# Altium project Controller.PrjPcb
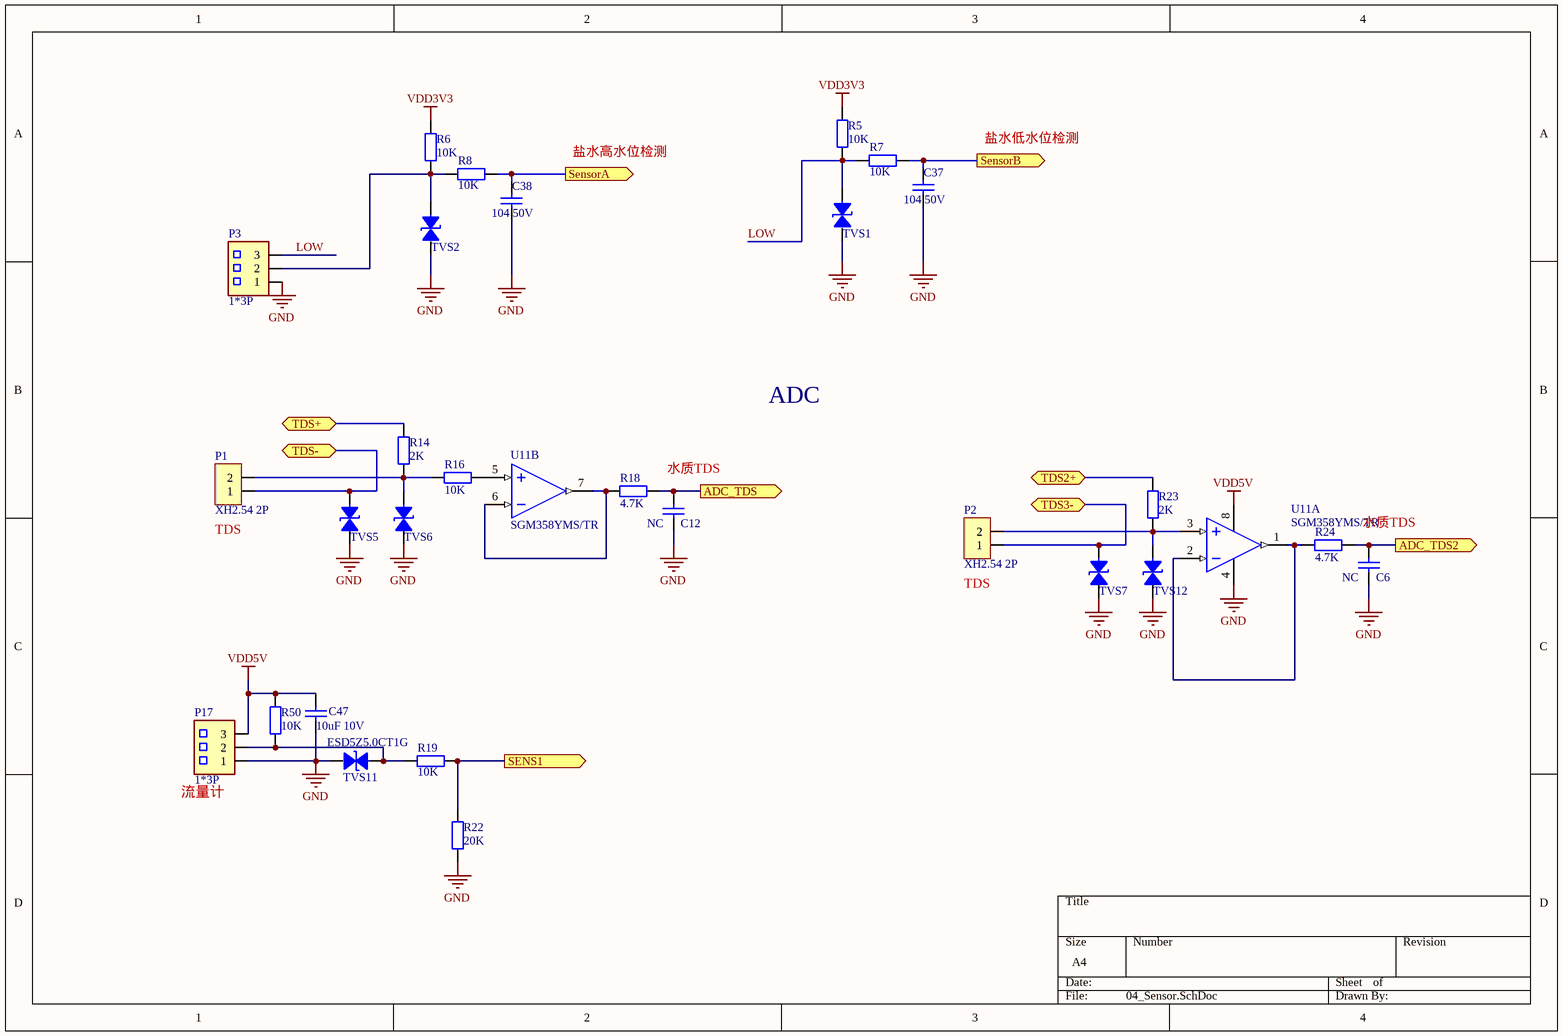
[diagram p0: 04_Sensor.SchDoc]
6 sheets, 167 parts. Net scope: global (net labels, ports and power ports of the same name join across sheets).
Board file: 电解模块主控板_V1.1_ZM_20210918.PcbDoc
Sheets:
  04_Sensor.SchDoc
  08_Peripherals.SchDoc
  02_Power.SchDoc
  com.SchDoc
  15_LCD.SchDoc
  07_EL_CON.SchDoc

## Sheet 04_Sensor.SchDoc
size A4

### Parts
C6  NC  [0603C]
C12  NC  [SMD-0603C]
C37  104 50V  [SMD-0603C]
C38  104 50V  [SMD-0603C]
C47  10uF 10V  [SMD-0603C]
P1  XH2.54 2P  [SIP-2A]
P2  XH2.54 2P  [SIP-2A]
P3  1*3P  [3X2MMZ]
P17  1*3P  [3X2.54MMZ2]
R5  10K  [SMD-0603]
R6  10K  [SMD-0603]
R7  10K  [SMD-0603]
R8  10K  [SMD-0603]
R14  2K  [SMD-0603]
R16  10K  [SMD-0603]
R18  4.7K  [SMD-0603]
R19  10K  [SMD-0603]
R22  20K  [SMD-0603]
R23  2K  [0603R]
R24  4.7K  [0603R]
R50  10K  [SMD-0603]
TVS1  ESD5Z5.0CT1G  [SOD-523]  (value not drawn)
TVS2  ESD5Z5.0CT1G  [SOD-523]  (value not drawn)
TVS5  ESD5Z5.0CT1G  [SOD-523]  (value not drawn)
TVS6  ESD5Z5.0CT1G  [SOD-523]  (value not drawn)
TVS7  ESD5Z5.0CT1G  [SOD-523]  (value not drawn)
TVS11  ESD5Z5.0CT1G  [SOD-523]
TVS12  ESD5Z5.0CT1G  [SOD-523]  (value not drawn)
U11  SGM358YMS/TR  [MSOP-8]  (parts A,B of 2)

### Ports
ADC_TDS2 (out), ADC_TDS (out), SENS1 (out), SensorA (out), SensorB (out), TDS2+ (bidir), TDS3- (bidir), TDS+ (bidir), TDS- (bidir)

### Nets
GND: C6.1 C12.1 C37.1 C38.1 C47.1 P3.1 P17.1 R22.1 TVS1.1(A) TVS2.1(A) TVS5.1(A) TVS6.1(A) TVS7.1(A) TVS11.1(A) TVS12.1(A) U11.4(V-)
VDD3V3: R5.1 R6.1  [project net 3.3V]
VDD5V: C47.2 P17.3 R50.1 U11.8(V+)
LOW: P3.3 R5.2 R7.1 TVS1.2(B)
NetC6_2: C6.2 R24.1 ; port ADC_TDS2
NetC12_2: C12.2 R18.1 ; port ADC_TDS
NetC37_2: C37.2 R7.2 ; port SensorB
NetC38_2: C38.2 R8.2 ; port SensorA
NetP1_1: P1.1 TVS5.2(B) ; port TDS-
NetP1_2: P1.2 R14.2 R16.1 TVS6.2(B)
NetP2_1: P2.1 TVS7.2(B) ; port TDS3-
NetP2_2: P2.2 R23.2 TVS12.2(B) U11.3(IN1+)
NetP3_2: P3.2 R6.2 R8.1 TVS2.2(B)
NetP17_2: P17.2 R19.1 R50.2 TVS11.2(B)
NetR14_1: R14.1 ; port TDS+
NetR16_2: R16.2 U11.5(IN2+)
NetR18_2: R18.2 U11.6(IN2-) U11.7(OUT2)
NetR19_2: R19.2 R22.2 ; port SENS1
NetR23_1: R23.1 ; port TDS2+
NetR24_2: R24.2 U11.1(OUT1) U11.2(IN1-)

### Notes on the sheet
- 盐水高水位检测
- 盐水低水位检测
- ADC
- 水质TDS
- (near P1) TDS
- (near P2) TDS
- (near P17) 流量计

### Library data of the parts
C6 C12 = CAP4: 贴片电容 10%
C37 C38 = CAP4: 贴片电容 20%
C47 = 0805 22uF (226) 20% 25V: 贴片电容 10%; value: 22uF 10V X5R; ComponentLink1Description: 供应商链接; ComponentLink1URL: http://www.szlcsc.com/product/details_46786.html; Package: 0805; Supplier: LC; SuppliersPartNumber: C45783
P1 P2 = SIP-2: XH2.54 2P 直插
P3 P17 = HDR1*3
R5-R8 R14 R16 R23 = RES0: 贴片电阻 1%
R18 R24 = RES0: 贴片电阻 5%
R19 R22 R50 = 0603 10KΩ (1002) 1%: 贴片电阻 5%; ComponentLink1Description: 供应商链接; ComponentLink1URL: http://www.szlcsc.com/product/details_26547.html; Package: 0603; Supplier: LC; SuppliersPartNumber: C25804
TVS1 TVS2 TVS5-TVS7 TVS12 = TVS-1: TVS
TVS11 = TVS-1: TVS 5.0V
U11 = LM358: 运放

## Sheet 08_Peripherals.SchDoc
size A4
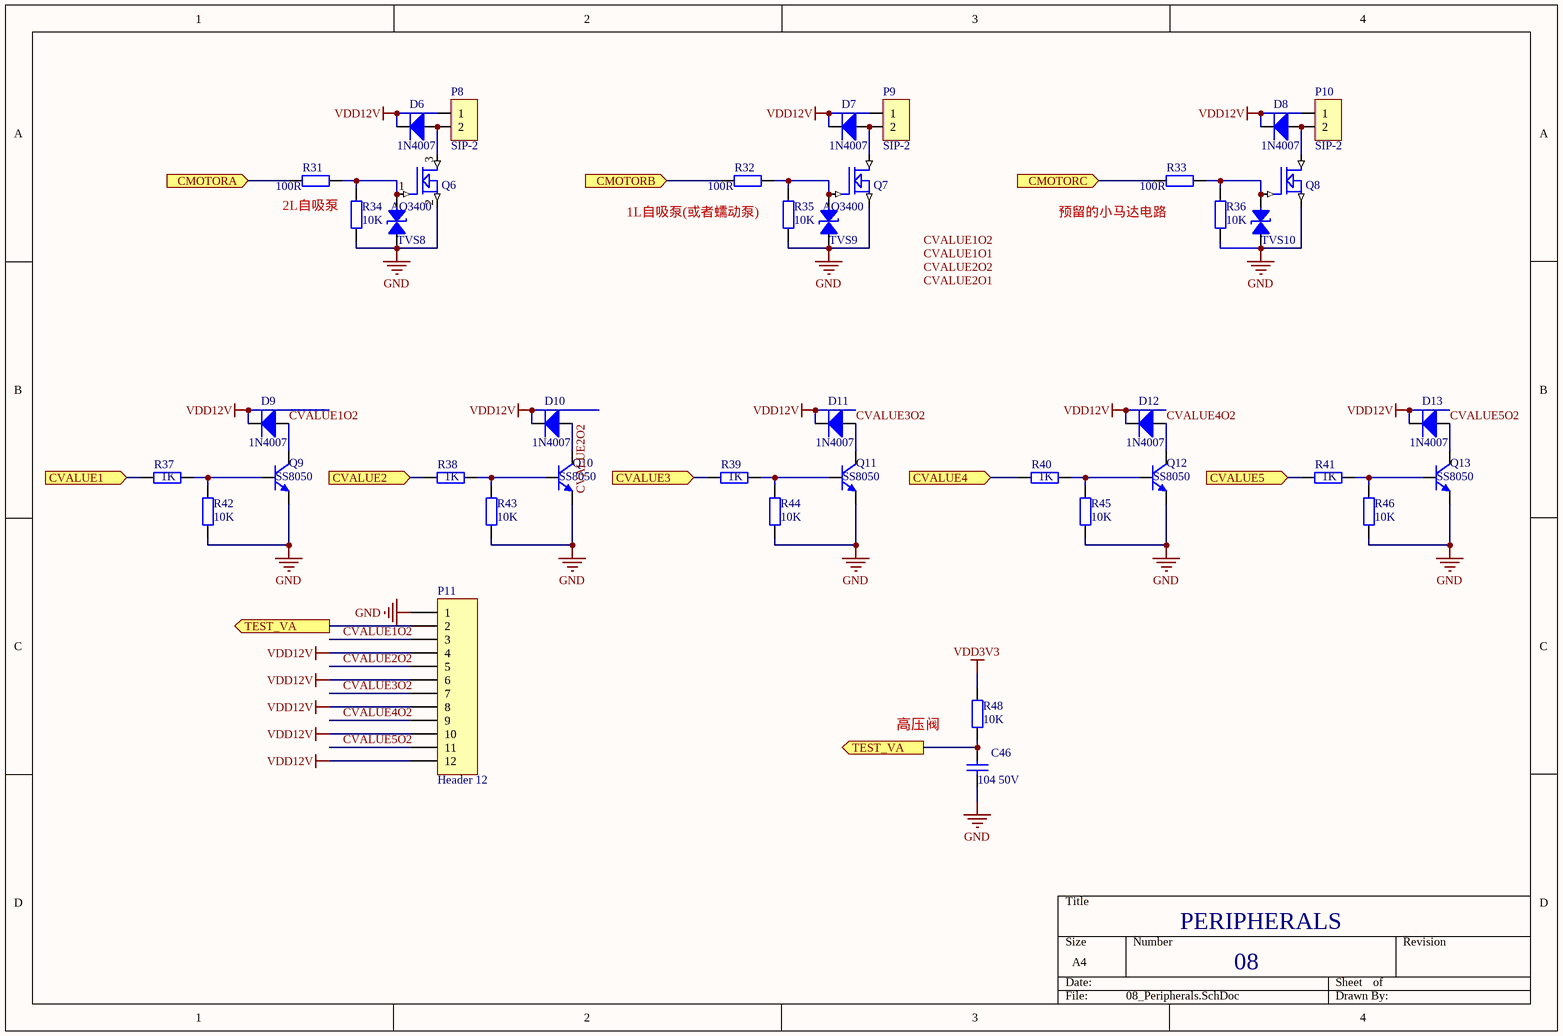
[diagram p1: 08_Peripherals.SchDoc]

### Parts
C46  104 50V  [SMD-0603C]
D6  1N4007  [DO-214-AC]
D7  1N4007  [DO-214-AC]
D8  1N4007  [DO-214-AC]
D9  1N4007  [DO-214-AC]
D10  1N4007  [DO-214-AC]
D11  1N4007  [DO-214-AC]
D12  1N4007  [DO-214-AC]
D13  1N4007  [DO-214-AC]
P8  SIP-2  [SIP-2A]
P9  SIP-2  [SIP-2A]
P10  SIP-2  [SIP-2A]
P11  Header 12  [12X2.54MMZ]
Q6  AO3400  [SOT-23]
Q7  AO3400  [SOT-23]
Q8  AO3400  [SOT-23]  (value not drawn)
Q9  SS8050  [SOT-23]
Q10  SS8050  [SOT-23]
Q11  SS8050  [SOT-23]
Q12  SS8050  [SOT-23]
Q13  SS8050  [SOT-23]
R31  100R  [SMD-0603]
R32  100R  [SMD-0603]
R33  100R  [SMD-0603]
R34  10K  [SMD-0603]
R35  10K  [SMD-0603]
R36  10K  [SMD-0603]
R37  1K  [SMD-0603]
R38  1K  [SMD-0603]
R39  1K  [SMD-0603]
R40  1K  [SMD-0603]
R41  1K  [SMD-0603]
R42  10K  [SMD-0603]
R43  10K  [SMD-0603]
R44  10K  [SMD-0603]
R45  10K  [SMD-0603]
R46  10K  [SMD-0603]
R48  10K  [SMD-0603]
TVS8  ESD5Z5.0CT1G  [SOD-523]  (value not drawn)
TVS9  ESD5Z5.0CT1G  [SOD-523]  (value not drawn)
TVS10  ESD5Z5.0CT1G  [SOD-523]  (value not drawn)

### Ports
CMOTORA (in), CMOTORB (in), CMOTORC (in), CVALUE1 (in), CVALUE2 (in), CVALUE3 (in), CVALUE4 (in), CVALUE5 (in), TEST_VA (out)

### Nets
GND: C46.1 P11.1 Q6.2(S) Q7.2(S) Q8.2(S) Q9.2(E) Q10.2(E) Q11.2(E) Q12.2(E) Q13.2(E) R34.2 R35.2 R36.2 R42.2 R43.2 R44.2 R45.2 R46.2 TVS8.1(A) TVS9.1(A) TVS10.1(A)
VDD3V3: R48.2  [project net 3.3V]
VDD12V: D6.2(K) D7.2(K) D8.2(K) D9.2(K) D10.2(K) D11.2(K) D12.2(K) D13.2(K) P8.1 P9.1 P10.1 P11.4 P11.6 P11.8 P11.10 P11.12
CVALUE1O2: D9.1(A) P11.3 Q9.3(C)
CVALUE2O2: D10.1(A) P11.5 Q10.3(C)
CVALUE3O2: D11.1(A) P11.7 Q11.3(C)
CVALUE4O2: D12.1(A) P11.9 Q12.3(C)
CVALUE5O2: D13.1(A) P11.11 Q13.3(C)
NetC46_2: C46.2 P11.2 R48.1 ; port TEST_VA
NetD6_1: D6.1(A) P8.2 Q6.3(D)
NetD7_1: D7.1(A) P9.2 Q7.3(D)
NetD8_1: D8.1(A) P10.2 Q8.3(D)
NetQ6_1: Q6.1(G) R31.1 R34.1 TVS8.2(B)
NetQ7_1: Q7.1(G) R32.1 R35.1 TVS9.2(B)
NetQ8_1: Q8.1(G) R33.1 R36.1 TVS10.2(B)
NetQ9_1: Q9.1(B) R37.1 R42.1
NetQ10_1: Q10.1(B) R38.1 R43.1
NetQ11_1: Q11.1(B) R39.1 R44.1
NetQ12_1: Q12.1(B) R40.1 R45.1
NetQ13_1: Q13.1(B) R41.1 R46.1
NetR31_2: R31.2 ; port CMOTORA
NetR32_2: R32.2 ; port CMOTORB
NetR33_2: R33.2 ; port CMOTORC
NetR37_2: R37.2 ; port CVALUE1
NetR38_2: R38.2 ; port CVALUE2
NetR39_2: R39.2 ; port CVALUE3
NetR40_2: R40.2 ; port CVALUE4
NetR41_2: R41.2 ; port CVALUE5

### Notes on the sheet
- (near R31) 2L自吸泵
- (near R32) 1L自吸泵(或者蠕动泵)
- 预留的小马达电路
- 高压阀
- PERIPHERALS
- 08
- Labels drawn without touching a wire or pin: CVALUE1O1, CVALUE1O2, CVALUE2O1, CVALUE2O2

### Library data of the parts
C46 = CAP4: 贴片电容 10%
D6-D13 = DIODE2: 贴片二极管
P8-P10 = SIP-2: XH2.54 2P 立贴
P11 = Header 12: Header, 12-Pin; LatestRevisionDate: 17-Jul-2002; LatestRevisionNote: Re-released for DXP Platform.; Publisher: Altium Limited
Q6-Q8 = MOSFET N
Q9-Q13 = NPN-1: 三极管
R31-R46 R48 = RES-SOP: 贴片电阻 5%
TVS8-TVS10 = TVS-1: TVS

## Sheet 02_Power.SchDoc
size A4
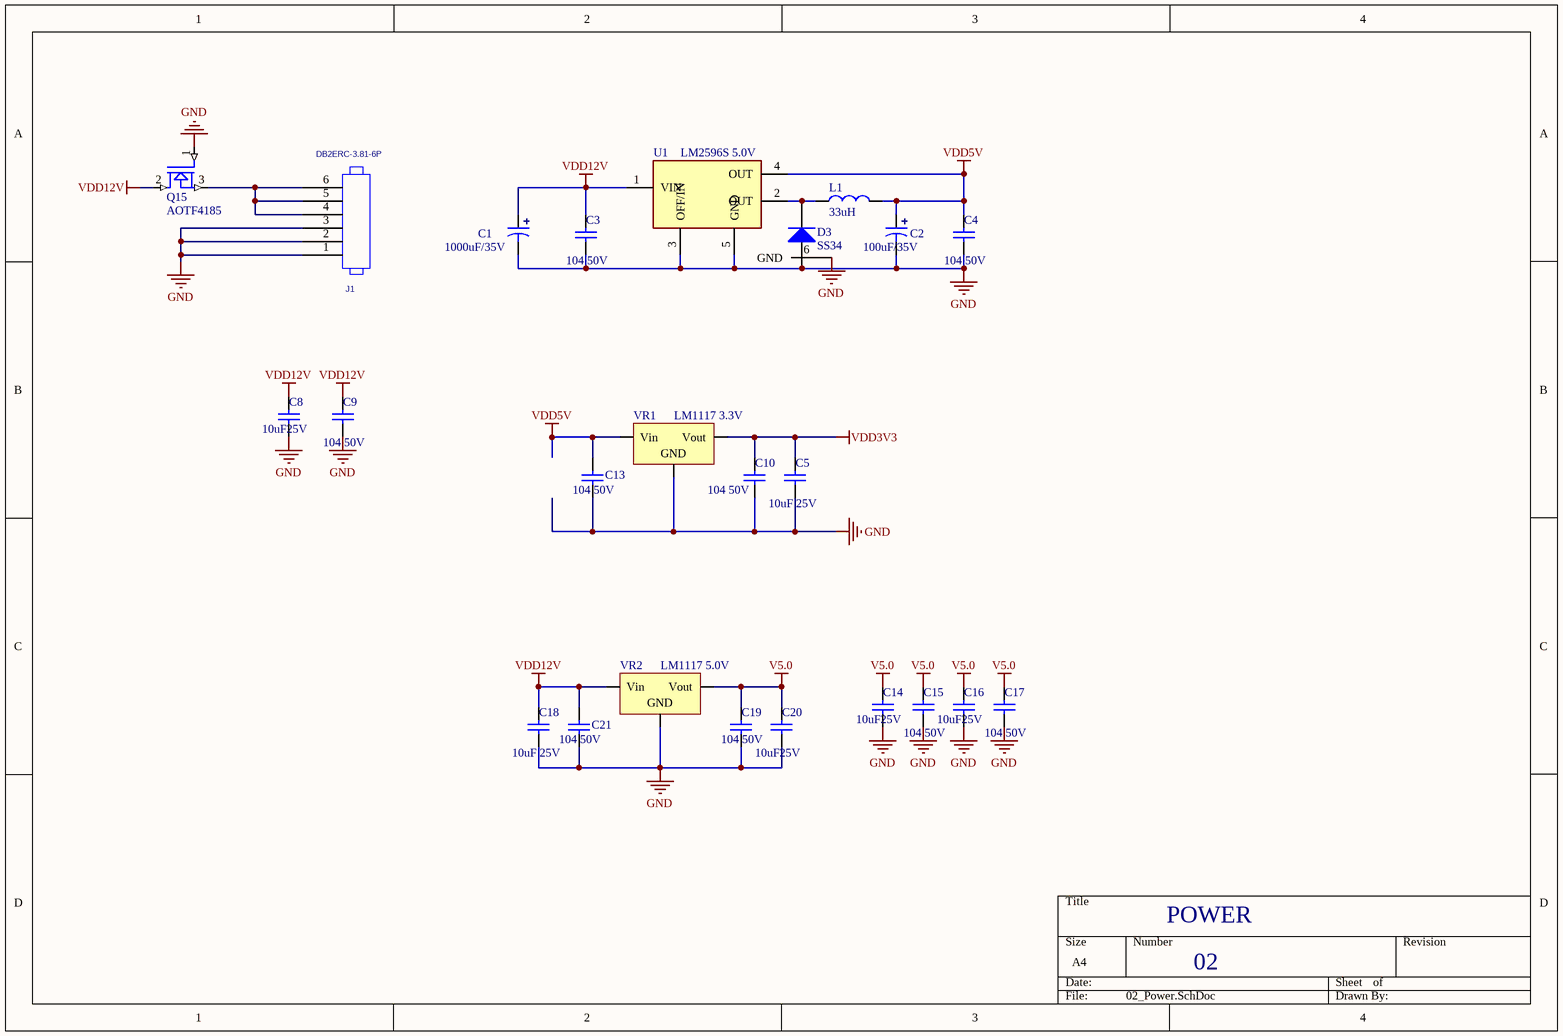
[diagram p2: 02_Power.SchDoc]

### Parts
C1  1000uF/35V  [10*16]
C2  100uF/35V  [6*8]
C3  104 50V  [SMD-0805C]
C4  104 50V  [SMD-0805C]
C5  10uF 25V  [SMD-0603C]
C8  10uF25V  [SMD-0603C]
C9  104 50V  [SMD-0603C]
C10  104 50V  [SMD-0603C]
C13  104 50V  [SMD-0603C]
C14  10uF25V  [SMD-0603C]
C15  104 50V  [SMD-0603C]
C16  10uF25V  [SMD-0603C]
C17  104 50V  [SMD-0603C]
C18  10uF 25V  [SMD-0603C]
C19  104 50V  [SMD-0603C]
C20  10uF25V  [SMD-0603C]
C21  104 50V  [SMD-0603C]
D3  SS34  [SMA]
J1  value DB2ERC-3.81-6P  [VH-AW-3.96*6P]  (hidden comment: HEADER_6)
L1  33uH  [CDRH-127]
Q15  AOTF4185  [to220]
U1  LM2596S 5.0V  [TO-263-5]
VR1  LM1117 3.3V  [SOT223]
VR2  LM1117 5.0V  [SOT223]

### Nets
GND: C1.2 C2.2 C3.1 C4.1 C5.1 C8.1 C9.1 C10.1 C13.1 C14.1 C15.1 C16.1 C17.1 C18.1 C19.1 C20.1 C21.1 D3.1(A) J1.1 J1.2 J1.3 Q15.1(G) U1.3(OFF/IN) U1.5(GND) U1.6(GND) VR1.1(GND) VR2.1(GND)
V5.0: C14.2 C15.2 C16.2 C17.2 C19.2 C20.2 VR2.2(Vout)
VDD3V3: C5.2 C10.2 VR1.2(Vout)  [project net 3.3V]
VDD5V: C2.1 C4.2 C13.2 L1.2 U1.4(OUT) VR1.3(Vin)
VDD12V: C1.1 C3.2 C8.2 C9.2 C18.2 C21.2 Q15.2(D) U1.1(VIN) VR2.3(Vin)
NetD3_2: D3.2(K) L1.1 U1.2(OUT)
NetJ1_4: J1.4 J1.5 J1.6 Q15.3(S)

### Notes on the sheet
- POWER
- 02

### Library data of the parts
C1 C2 = CAP2: 电解电容
C3 C4 C8-C10 C13 = CAP4: 贴片电容 10%
C5 C14-C21 = CAP4: 贴片电容 20%
D3 = DIODE
J1 = HEADER_6: PCB DECAL: DB2ERC-3P81-6P; Source_Path: C:\MYPROGRAM\CADENCE\SPB_16.6\TOOLS\CAPTURE\LIBRARY\CONNECTOR.OLB
L1 = IND
Q15 = MOSFET N
U1 = LM2596
VR1 = LM1117: 三端稳压器
VR2 = LM1117: 三端稳压器 （耐压20V）

## Sheet com.SchDoc
size A4
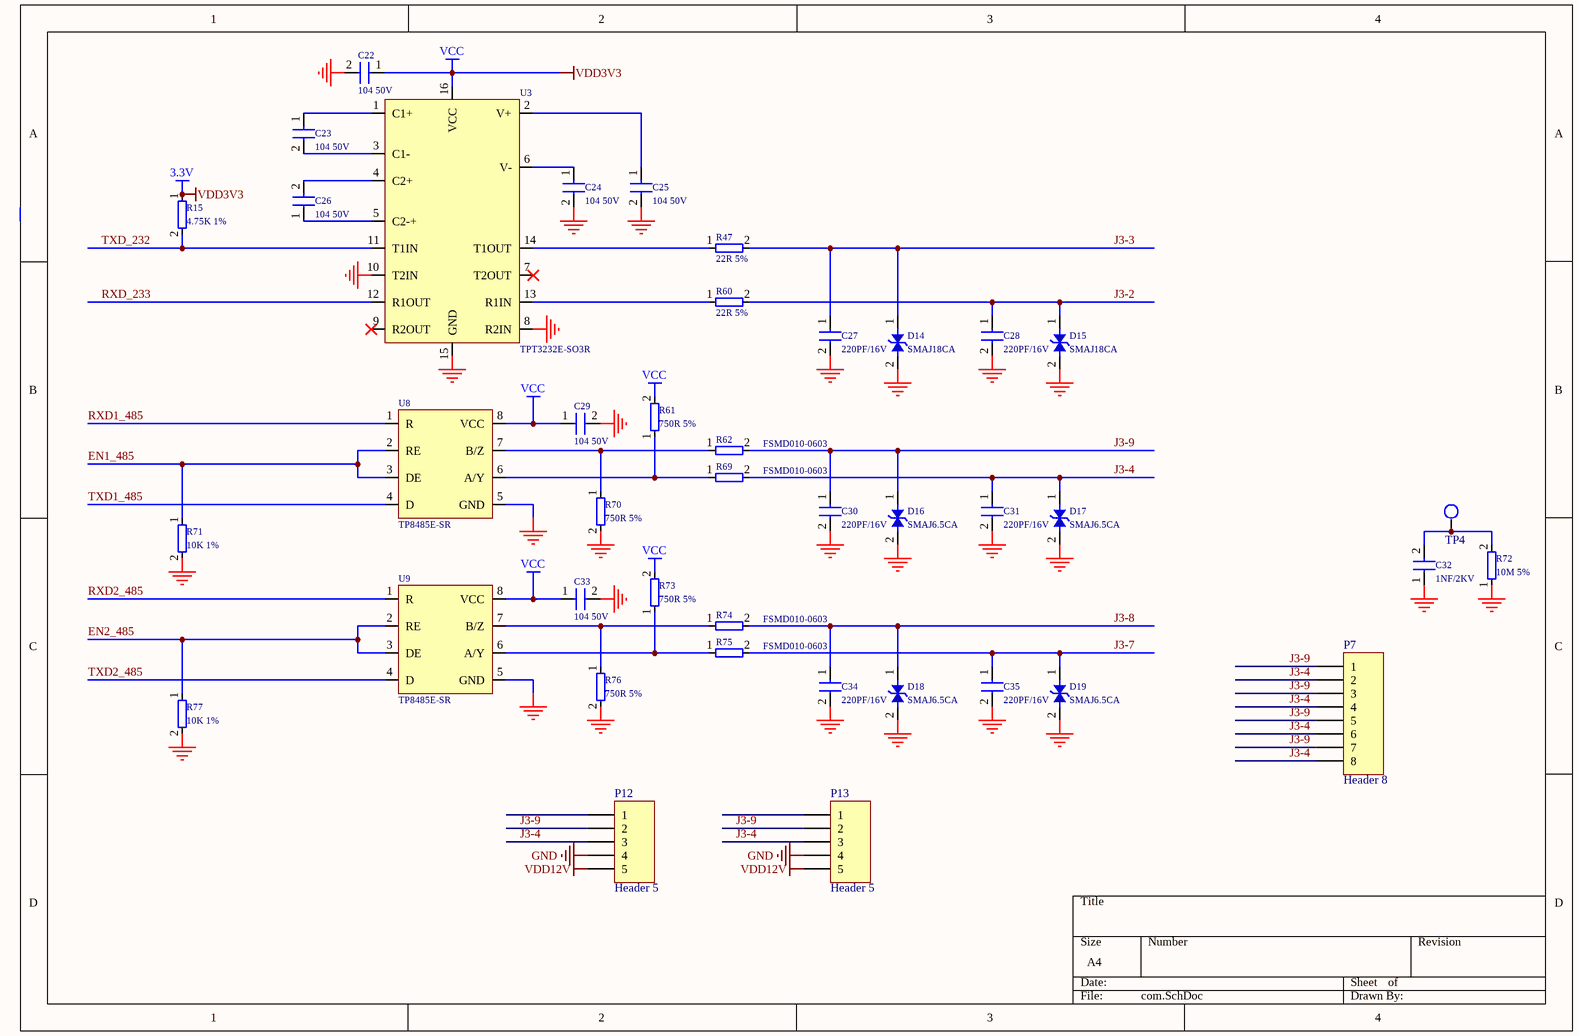
[diagram p3: com.SchDoc]

### Parts
C22  104 50V  [0603C]
C23  104 50V  [0603C]
C24  104 50V  [0603C]
C25  104 50V  [0603C]
C26  104 50V  [0603C]
C27  220PF/16V  [0603C]
C28  220PF/16V  [0603C]
C29  104 50V  [0603C]
C30  220PF/16V  [0603C]
C31  220PF/16V  [0603C]
C32  1NF/2KV  [1206C]
C33  104 50V  [0603C]
C34  220PF/16V  [0603C]
C35  220PF/16V  [0603C]
D14  SMAJ18CA  [SMA]
D15  SMAJ18CA  [SMA]
D16  SMAJ6.5CA  [SMA]
D17  SMAJ6.5CA  [SMA]
D18  SMAJ6.5CA  [SMA]
D19  SMAJ6.5CA  [SMA]
P7  Header 8  [8X2.54MMZ]
P12  Header 5  [5X2.54MMZ]
P13  Header 5  [5X2.54MMZ]
R15  4.75K 1%  [0603R]
R47  22R 5%  [0603R]
R60  22R 5%  [0603R]
R61  750R 5%  [0603R]
R62  FSMD010-0603  [0603R]
R69  FSMD010-0603  [0603R]
R70  750R 5%  [0603R]
R71  10K 1%  [0603R]
R72  10M 5%  [1206r]
R73  750R 5%  [0603R]
R74  FSMD010-0603  [0603R]
R75  FSMD010-0603  [0603R]
R76  750R 5%  [0603R]
R77  10K 1%  [0603R]
TP4  TPS  [tpd]  (value not drawn)
U3  TPT3232E-SO3R  [SO-16Z]
U8  TP8485E-SR  [SO-8]
U9  TP8485E-SR  [SO-8]

### Nets
3.3V: C22.1 C29.1 C33.1 R15.1 R61.2 R73.2 U3.16(VCC) U8.8(VCC) U9.8(VCC)  [also labelled VCC, VDD3V3]
GND: C22.2 C24.2 C25.2 C27.2 C28.2 C29.2 C30.2 C31.2 C32.1 C33.2 C34.2 C35.2 D14.2 D15.2 D16.2 D17.2 D18.2 D19.2 P12.4 P13.4 R70.2 R71.2 R72.1 R76.2 R77.2 U3.8(R2IN) U3.10(T2IN) U3.15(GND) U8.5(GND) U9.5(GND)
VDD12V: P12.5 P13.5
EN1_485: R71.1 U8.2(RE) U8.3(DE)
EN2_485: R77.1 U9.2(RE) U9.3(DE)
J3-2: C28.1 D15.1 R60.2
J3-3: C27.1 D14.1 R47.2
J3-4: C31.1 D17.1 P7.2 P7.4 P7.6 P7.8 P12.3 P13.3 R69.2
J3-7: C35.1 D19.1 R75.2
J3-8: C34.1 D18.1 R74.2
J3-9: C30.1 D16.1 P7.1 P7.3 P7.5 P7.7 P12.2 P13.2 R62.2
RXD1_485: U8.1(R)
RXD2_485: U9.1(R)
RXD_233: U3.12(R1OUT)
TXD1_485: U8.4(D)
TXD2_485: U9.4(D)
TXD_232: R15.2 U3.11(T1IN)
NetC23_1: C23.1 U3.1(C1+)
NetC23_2: C23.2 U3.3(C1-)
NetC24_1: C24.1 U3.6(V-)
NetC25_1: C25.1 U3.2(V+)
NetC26_1: C26.1 U3.5(C2-+)
NetC26_2: C26.2 U3.4(C2+)
NetC32_2: C32.2 R72.2 TP4.1
NetR47_1: R47.1 U3.14(T1OUT)
NetR60_1: R60.1 U3.13(R1IN)
NetR61_1: R61.1 R69.1 U8.6(A/Y)
NetR62_1: R62.1 R70.1 U8.7(B/Z)
NetR73_1: R73.1 R75.1 U9.6(A/Y)
NetR74_1: R74.1 R76.1 U9.7(B/Z)

Not connected (* = marked no-connect by the designer): P12 1; P13 1; U3 7(T2OUT)* 9(R2OUT)*

### Library data of the parts
C22-C35 = CAP
D14-D19 = D_ESD
P7 = Header 8: Header, 8-Pin; LatestRevisionDate: 17-Jul-2002; LatestRevisionNote: Re-released for DXP Platform.; Publisher: Altium Limited
P12 P13 = Header 5: Header, 5-Pin; LatestRevisionDate: 17-Jul-2002; LatestRevisionNote: Re-released for DXP Platform.; Publisher: Altium Limited
R15 R47 R60-R62 R69-R77 = RES

## Sheet 15_LCD.SchDoc
size A4
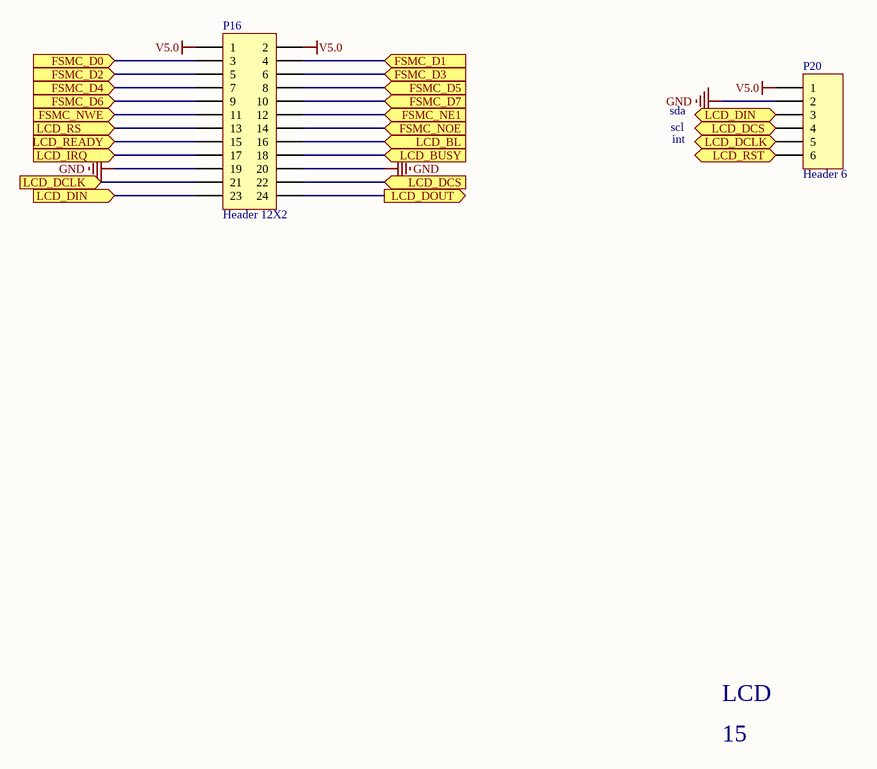
[diagram p4: 15_LCD.SchDoc]

### Parts
P16  Header 12X2  [HDR2X12]
P20  Header 6  [6X2MMZ]

### Ports
FSMC_D0 (in), FSMC_D1 (in), FSMC_D2 (in), FSMC_D3 (in), FSMC_D4 (in), FSMC_D5 (in), FSMC_D6 (in), FSMC_D7 (in), FSMC_NE1 (in), FSMC_NOE (in), FSMC_NWE (in), LCD_BL (in), LCD_BUSY (in), LCD_DCLK (in), LCD_DCS (in), LCD_DIN (in), LCD_DOUT (out), LCD_IRQ (in), LCD_READY (in), LCD_RS (in), LCD_RST (in)

### Nets
GND: P16.19 P16.20 P20.2
V5.0: P16.1 P16.2 P20.1
NetP16_3: P16.3 ; port FSMC_D0
NetP16_4: P16.4 ; port FSMC_D1
NetP16_5: P16.5 ; port FSMC_D2
NetP16_6: P16.6 ; port FSMC_D3
NetP16_7: P16.7 ; port FSMC_D4
NetP16_8: P16.8 ; port FSMC_D5
NetP16_9: P16.9 ; port FSMC_D6
NetP16_10: P16.10 ; port FSMC_D7
NetP16_11: P16.11 ; port FSMC_NWE
NetP16_12: P16.12 ; port FSMC_NE1
NetP16_13: P16.13 ; port LCD_RS
NetP16_14: P16.14 ; port FSMC_NOE
NetP16_15: P16.15 ; port LCD_READY
NetP16_16: P16.16 ; port LCD_BL
NetP16_17: P16.17 ; port LCD_IRQ
NetP16_18: P16.18 ; port LCD_BUSY
NetP16_21: P16.21 P20.5 ; port LCD_DCLK
NetP16_22: P16.22 P20.4 ; port LCD_DCS
NetP16_23: P16.23 P20.3 ; port LCD_DIN
NetP16_24: P16.24 ; port LCD_DOUT
NetP20_6: P20.6 ; port LCD_RST

### Notes on the sheet
- sda
- scl
- int
- LCD
- 15

### Library data of the parts
P16 = Header 12X2: Header, 12-Pin, Dual row; LatestRevisionDate: 17-Jul-2002; LatestRevisionNote: Re-released for DXP Platform.; Publisher: Altium Limited
P20 = Header 6: Header, 6-Pin; LatestRevisionDate: 17-Jul-2002; LatestRevisionNote: Re-released for DXP Platform.; Publisher: Altium Limited

## Sheet 07_EL_CON.SchDoc
size A4
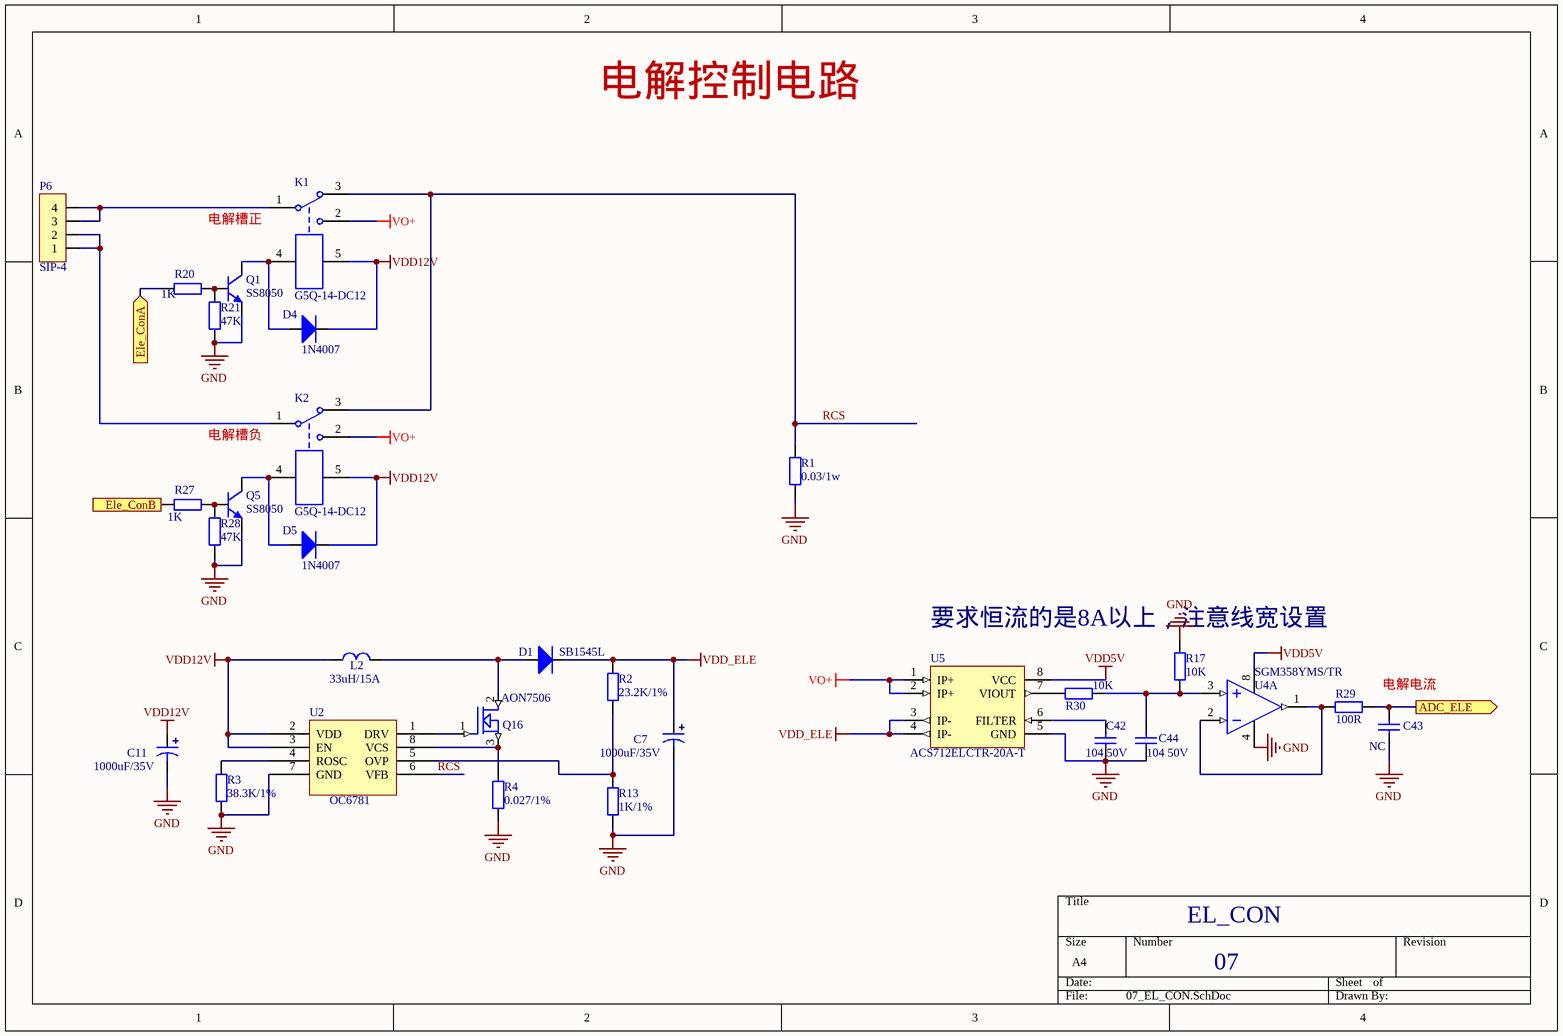
[diagram p5: 07_EL_CON.SchDoc]

### Parts
C7  1000uF/35V  [10*16]
C11  1000uF/35V  [10*16]
C42  104 50V  [SMD-0603C]
C43  NC  [SMD-0603C]
C44  104 50V  [SMD-0603C]
D1  SB1545L  [TO227]
D4  1N4007  [DO-214-AC]
D5  1N4007  [DO-214-AC]
K1  G5Q-14-DC12  [G5Q-14]
K2  G5Q-14-DC12  [G5Q-14]
L2  33uH/15A  [INDUCTOR_34*18]
P6  SIP-4  [VH-AW-3.96*4P]
Q1  SS8050  [SOT-23]
Q5  SS8050  [SOT-23]
Q16  AON7506  [DFN3*3-8]
R1  0.03/1w  [2512R]
R2  23.2K/1%  [SMD-0603]
R3  38.3K/1%  [SMD-0603]
R4  0.027/1%  [2512r]
R13  1K/1%  [SMD-0603]
R17  10K  [SMD-0603]
R20  1K  [SMD-0603]
R21  47K  [SMD-0603]
R27  1K  [SMD-0603]
R28  47K  [SMD-0603]
R29  100R  [SMD-0603]
R30  10K  [SMD-0603]
U2  OC6781  [SOP127P600X265_HS-9N]
U4  SGM358YMS/TR  [MSOP-8]  (part A of 2)
U5  ACS712ELCTR-20A-T  [SO-8]

### Ports
ADC_ELE (out), Ele_ConA (in), Ele_ConB (in)

### Nets
GND: C7.2 C11.2 C42.2 C43.1 C44.2 Q1.2(E) Q5.2(E) R1.2 R3.2 R4.2 R13.2 R17.1 R21.1 R28.1 U2.7(GND) U4.4(V-) U5.5(GND)
VDD5V: U4.8(V+) U5.8(VCC)
VDD12V: C11.1 D4.2(K) D5.2(K) K1.5 K2.5 L2.1 U2.2(VDD) U2.3(EN)
VDD_ELE: C7.1 D1.2(K) R2.1 U5.3(IP-) U5.4(IP-)
VO+: K1.2 K2.2 U5.1(IP+) U5.2(IP+)
RCS: K1.3 K2.3 R1.1 U2.6(VFB)
NetC42_1: C42.1 U5.6(FILTER)
NetC43_2: C43.2 R29.1 ; port ADC_ELE
NetC44_1: C44.1 R17.2 R30.1 U4.3(IN1+)
NetD1_1: D1.1(A) L2.2 Q16.2(D)
NetD4_1: D4.1(A) K1.4 Q1.3(C)
NetD5_1: D5.1(A) K2.4 Q5.3(C)
NetK1_1: K1.1 P6.3 P6.4
NetK2_1: K2.1 P6.1 P6.2
NetQ1_1: Q1.1(B) R20.2 R21.2
NetQ5_1: Q5.1(B) R27.2 R28.2
NetQ16_1: Q16.1(G) U2.1(DRV)
NetQ16_3: Q16.3(S) R4.1 U2.8(VCS)
NetR2_2: R2.2 R13.1 U2.5(OVP)
NetR3_1: R3.1 U2.4(ROSC)
NetR20_1: R20.1 ; port Ele_ConA
NetR27_1: R27.1 ; port Ele_ConB
NetR29_2: R29.2 U4.1(OUT1) U4.2(IN1-)
NetR30_2: R30.2 U5.7(VIOUT)

### Notes on the sheet
- 电解控制电路
- 电解槽正
- 电解槽负
- 要求恒流的是8A以上，注意线宽设置
- 电解电流
- EL_CON
- 07

### Library data of the parts
C7 C11 = CAP2: 电解电容
C42 = C: 贴片电容 10%
C43 C44 = CAP4: 贴片电容 10%
D1 = DIODE2: 肖特基二极管
D4 D5 = DIODE2: 贴片二极管
K1 K2 = JDQ1: 5V 继电器
L2 = Inductor1: 10uH 1A
P6 = SIP-4: 3.96 4P 直插
Q1 Q5 = NPN-1: 三极管
Q16 = MOSFET N
R1-R4 R13 = R: 贴片电阻 5%
R17 R30 = RES0: 贴片电阻 1%
R20 R21 R27 R28 = RES2: 贴片电阻 5%
R29 = RES0: 贴片电阻 5%
U4 = LM358: 运算放大器
U5 = ACS712: HALL 20A 电流传感器

## Nets that join several sheets
3.3V: 04_Sensor (R5.1 R6.1), 08_Peripherals (R48.2), 02_Power (C5.2 C10.2 VR1.2), com (9 pins)
GND: 04_Sensor (16 pins), 08_Peripherals (21 pins), 02_Power (27 pins), com (30 pins), 15_LCD (P16.19 P16.20 P20.2), 07_EL_CON (17 pins)
V5.0: 02_Power (7 pins), 15_LCD (P16.1 P16.2 P20.1)
VDD5V: 04_Sensor (C47.2 P17.3 R50.1 U11.8), 02_Power (6 pins), 07_EL_CON (U4.8 U5.8)
VDD12V: 08_Peripherals (16 pins), 02_Power (9 pins), com (P12.5 P13.5), 07_EL_CON (8 pins)